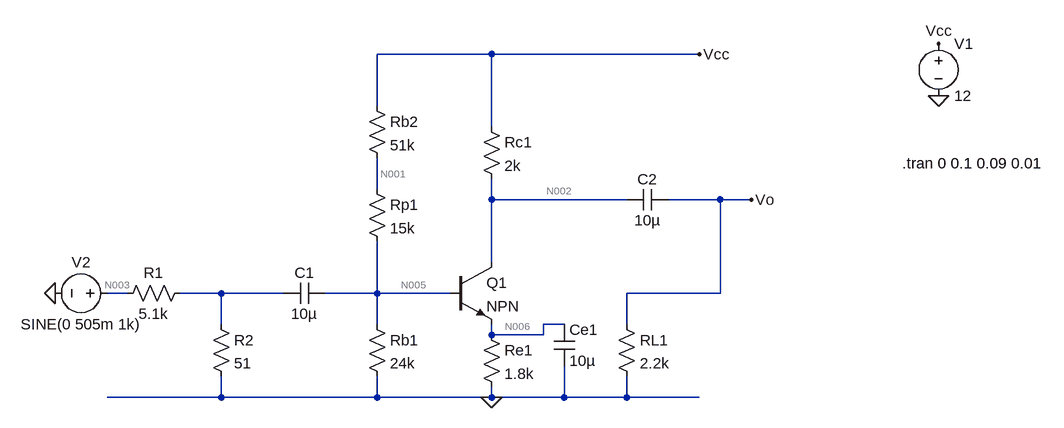
[diagram p0: schematic Experiment2_2_2.asc]
Experiment2_2_2.asc, the LTspice schematic file:
Version 4.1
SHEET 1 968 680
WIRE 96 -160 -80 -160
WIRE 416 -160 96 -160
WIRE -80 -80 -80 -160
WIRE 96 -48 96 -160
WIRE -80 48 -80 0
WIRE 96 64 96 32
WIRE 304 64 96 64
WIRE 448 64 368 64
WIRE 496 64 448 64
WIRE 96 160 96 64
WIRE -464 208 -496 208
WIRE -320 208 -384 208
WIRE -224 208 -320 208
WIRE -80 208 -80 128
WIRE -80 208 -160 208
WIRE 32 208 -80 208
WIRE 448 208 448 64
WIRE 448 208 304 208
WIRE -320 256 -320 208
WIRE -80 256 -80 208
WIRE 208 256 176 256
WIRE 304 256 304 208
WIRE 96 272 96 256
WIRE 176 272 176 256
WIRE 176 272 96 272
WIRE -320 368 -320 336
WIRE -320 368 -496 368
WIRE -80 368 -80 336
WIRE -80 368 -320 368
WIRE 96 368 96 352
WIRE 96 368 -80 368
WIRE 208 368 208 320
WIRE 208 368 96 368
WIRE 304 368 304 336
WIRE 304 368 208 368
WIRE 416 368 304 368
FLAG 96 368 0
FLAG 416 -160 Vcc
FLAG 784 -176 Vcc
FLAG 784 -96 0
FLAG 496 64 Vo
FLAG -576 208 0
SYMBOL res -368 192 R90
WINDOW 0 0 56 VBottom 2
WINDOW 3 32 56 VTop 2
SYMATTR InstName R1
SYMATTR Value 5.1k
SYMBOL res -336 240 R0
SYMATTR InstName R2
SYMATTR Value 51
SYMBOL res -96 240 R0
SYMATTR InstName Rb1
SYMATTR Value 24k
SYMBOL res -96 32 R0
SYMATTR InstName Rp1
SYMATTR Value 15k
SYMBOL res -96 -96 R0
SYMATTR InstName Rb2
SYMATTR Value 51k
SYMBOL npn 32 160 R0
SYMATTR InstName Q1
SYMBOL res 80 256 R0
SYMATTR InstName Re1
SYMATTR Value 1.8k
SYMBOL res 288 240 R0
SYMATTR InstName RL1
SYMATTR Value 2.2k
SYMBOL res 80 -64 R0
SYMATTR InstName Rc1
SYMATTR Value 2k
SYMBOL voltage 784 -192 R0
WINDOW 123 0 0 Left 0
WINDOW 39 0 0 Left 0
SYMATTR InstName V1
SYMATTR Value 12
SYMBOL cap -160 192 R90
WINDOW 0 0 32 VBottom 2
WINDOW 3 32 32 VTop 2
SYMATTR InstName C1
SYMATTR Value 10µ
SYMATTR SpiceLine V=6.3 Irms=0 Rser=4 Lser=0 mfg="AVX" pn="TAJA106M006" type="Tantalum"
SYMBOL cap 304 80 R270
WINDOW 0 32 32 VTop 2
WINDOW 3 0 32 VBottom 2
SYMATTR InstName C2
SYMATTR Value 10µ
SYMATTR SpiceLine V=6.3 Irms=0 Rser=4 Lser=0 mfg="AVX" pn="TAJA106M006" type="Tantalum"
SYMBOL cap 192 256 R0
SYMATTR Value 10µ
SYMATTR InstName Ce1
SYMATTR SpiceLine V=6.3 Irms=0 Rser=4 Lser=0 mfg="AVX" pn="TAJA106M006" type="Tantalum"
SYMBOL voltage -480 208 R90
WINDOW 0 -32 56 VBottom 2
WINDOW 3 32 56 VTop 2
WINDOW 123 0 0 Left 0
WINDOW 39 0 0 Left 0
SYMATTR InstName V2
SYMATTR Value SINE(0 505m 1k)
TEXT 728 8 Left 2 !.tran 0 0.1 0.09 0.01

The netlist it stands for:
* Experiment2_2_2.asc
R1 N004 N003 5.1k
R2 N004 0 51
Rb1 N005 0 24k
Rp1 N001 N005 15k
Rb2 Vcc N001 51k
Q1 N002 N005 N006 0 NPN
Re1 N006 0 1.8k
RL1 Vo 0 2.2k
Rc1 Vcc N002 2k
V1 Vcc 0 12
C1 N005 N004 10µ V=6.3 Irms=0 Rser=4 Lser=0 mfg="AVX" pn="TAJA106M006" type="Tantalum"
C2 N002 Vo 10µ V=6.3 Irms=0 Rser=4 Lser=0 mfg="AVX" pn="TAJA106M006" type="Tantalum"
Ce1 N006 0 10µ V=6.3 Irms=0 Rser=4 Lser=0 mfg="AVX" pn="TAJA106M006" type="Tantalum"
V2 N003 0 SINE(0 505m 1k)
.model NPN NPN
.model PNP PNP
.lib standard.bjt
.tran 0 0.1 0.09 0.01
.backanno
.end

* Results of the author's LTspice run, read from the files saved beside the schematic
* Operating Point, zero values left out:
*   V(n001) = 5.035 V
*   V(vcc) = 12 V
*   V(n006) = 2.207 V
*   V(n005) = 2.986 V
*   V(n002) = 9.572 V
*   Ic(Q1) = 1.214 mA
*   Ib(Q1) = 12.14 µA
*   Ie(Q1) = -1.226 mA
*   I(Rb1) = 124.4 µA
*   I(Rb2) = 136.6 µA
*   I(Rp1) = 136.6 µA
*   I(Re1) = 1.226 mA
*   I(V1) = -1.351 mA
*   I(Rc1) = 1.214 mA
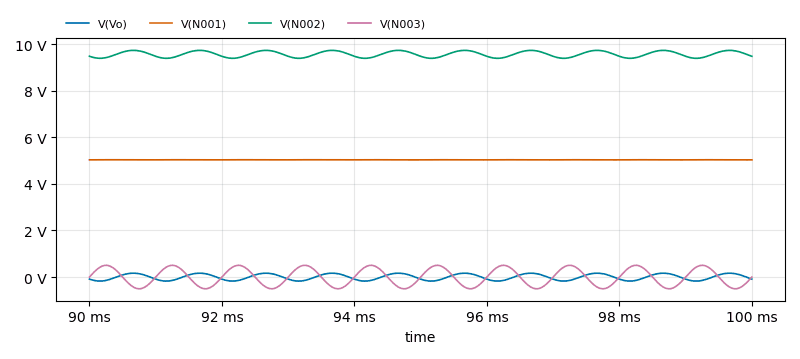
[diagram p1: Transient Analysis of Experiment2_2_2.asc, plotted from the saved traces]
* Transient Analysis, 1 run:
*   V(Vo): min -174.3 mV, max 166 mV, average 20.17 µV, rms 120.4 mV, last -89.34 mV
*   V(N001): min 5.031 V, max 5.039 V, average 5.035 V, rms 5.035 V, last 5.035 V
*   V(N002): min 9.397 V, max 9.738 V, average 9.572 V, rms 9.573 V, last 9.483 V
*   V(N003): min -505 mV, max 504.9 mV, average 11.18 µV, rms 357.3 mV, last 0 V